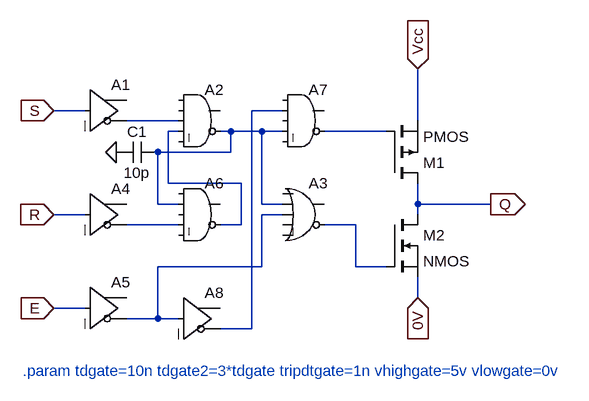
[diagram p0: schematic 4043.asc]
4043.asc, the LTspice schematic file:
Version 4
SHEET 1 1080 748
WIRE 160 144 112 144
WIRE 464 144 416 144
WIRE 304 160 224 160
WIRE 672 160 672 80
WIRE 304 176 288 176
WIRE 384 176 368 176
WIRE 432 176 384 176
WIRE 464 176 432 176
WIRE 624 176 528 176
WIRE 384 208 384 176
WIRE 384 208 272 208
WIRE 288 256 288 176
WIRE 400 256 288 256
WIRE 272 288 272 208
WIRE 304 288 272 288
WIRE 432 288 432 176
WIRE 464 288 432 288
WIRE 672 288 672 256
WIRE 784 288 672 288
WIRE 160 304 112 304
WIRE 464 304 432 304
WIRE 672 304 672 288
WIRE 304 320 224 320
WIRE 400 320 400 256
WIRE 400 320 368 320
WIRE 576 320 528 320
WIRE 432 384 432 304
WIRE 432 384 272 384
WIRE 576 384 576 320
WIRE 624 384 576 384
WIRE 672 432 672 400
WIRE 160 448 112 448
WIRE 272 464 272 384
WIRE 272 464 224 464
WIRE 304 464 272 464
WIRE 416 480 416 144
WIRE 416 480 368 480
FLAG 672 80 Vcc
IOPIN 672 80 In
FLAG 784 288 Q
IOPIN 784 288 Out
FLAG 112 144 S
IOPIN 112 144 In
FLAG 112 304 R
IOPIN 112 304 In
FLAG 208 208 0
FLAG 112 448 E
IOPIN 112 448 In
FLAG 672 432 0V
IOPIN 672 432 In
SYMBOL Digital\\buf 160 80 R0
SYMATTR InstName A1
SYMATTR Value2 td={tdgate} tripdt={tripdtgate} vhigh={vhighgate} vlow={vlowgate}
SYMBOL Digital\\and 336 96 R0
SYMATTR InstName A2
SYMATTR Value2 td={tdgate} tripdt={tripdtgate} vhigh={vhighgate} vlow={vlowgate}
SYMBOL Digital\\or 496 240 R0
SYMATTR InstName A3
SYMATTR Value2 td={tdgate} tripdt={tripdtgate} vhigh={vhighgate} vlow={vlowgate}
SYMBOL Digital\\buf 160 240 R0
SYMATTR InstName A4
SYMATTR Value2 td={tdgate} tripdt={tripdtgate} vhigh={vhighgate} vlow={vlowgate}
SYMBOL Digital\\buf 160 384 R0
SYMATTR InstName A5
SYMATTR Value2 td={tdgate} tripdt={tripdtgate} vhigh={vhighgate} vlow={vlowgate}
SYMBOL Digital\\and 336 240 R0
SYMATTR InstName A6
SYMATTR Value2 td={tdgate} tripdt={tripdtgate} vhigh={vhighgate} vlow={vlowgate}
SYMBOL Digital\\and 496 96 R0
SYMATTR InstName A7
SYMATTR Value2 td={tdgate} tripdt={tripdtgate} vhigh={vhighgate} vlow={vlowgate}
SYMBOL Digital\\buf 304 400 R0
SYMATTR InstName A8
SYMATTR Value2 td={tdgate} tripdt={tripdtgate} vhigh={vhighgate} vlow={vlowgate}
SYMBOL pmos 624 256 M180
SYMATTR InstName M1
SYMBOL nmos 624 304 R0
SYMATTR InstName M2
SYMBOL cap 272 192 R90
WINDOW 0 0 32 VBottom 2
WINDOW 3 32 32 VTop 2
SYMATTR InstName C1
SYMATTR Value 10p
TEXT 64 544 Left 2 ;.param tdgate=10n tdgate2=3*tdgate tripdtgate=1n vhighgate=5v vlowgate=0v

The netlist it stands for:
* 4043.asc
A1 S 0 0 0 0 N002 0 0 BUF td={tdgate} tripdt={tripdtgate} vhigh={vhighgate} vlow={vlowgate}
A2 0 0 N002 N003 0 N004 0 0 AND td={tdgate} tripdt={tripdtgate} vhigh={vhighgate} vlow={vlowgate}
A3 0 N004 N006 0 0 N008 0 0 OR td={tdgate} tripdt={tripdtgate} vhigh={vhighgate} vlow={vlowgate}
A4 R 0 0 0 0 N007 0 0 BUF td={tdgate} tripdt={tripdtgate} vhigh={vhighgate} vlow={vlowgate}
A5 E 0 0 0 0 N006 0 0 BUF td={tdgate} tripdt={tripdtgate} vhigh={vhighgate} vlow={vlowgate}
A6 0 N004 0 N007 0 N003 0 0 AND td={tdgate} tripdt={tripdtgate} vhigh={vhighgate} vlow={vlowgate}
A7 0 N001 0 N004 0 N005 0 0 AND td={tdgate} tripdt={tripdtgate} vhigh={vhighgate} vlow={vlowgate}
A8 N006 0 0 0 0 N001 0 0 BUF td={tdgate} tripdt={tripdtgate} vhigh={vhighgate} vlow={vlowgate}
M1 Q N005 Vcc Vcc PMOS
M2 Q N008 0V 0V NMOS
C1 N004 0 10p
.model NMOS NMOS
.model PMOS PMOS
.lib standard.mos
* .param tdgate=10n tdgate2=3*tdgate tripdtgate=1n vhighgate=5v vlowgate=0v
.backanno
.end